# Altium schematic sheet power.SchDoc
size A4
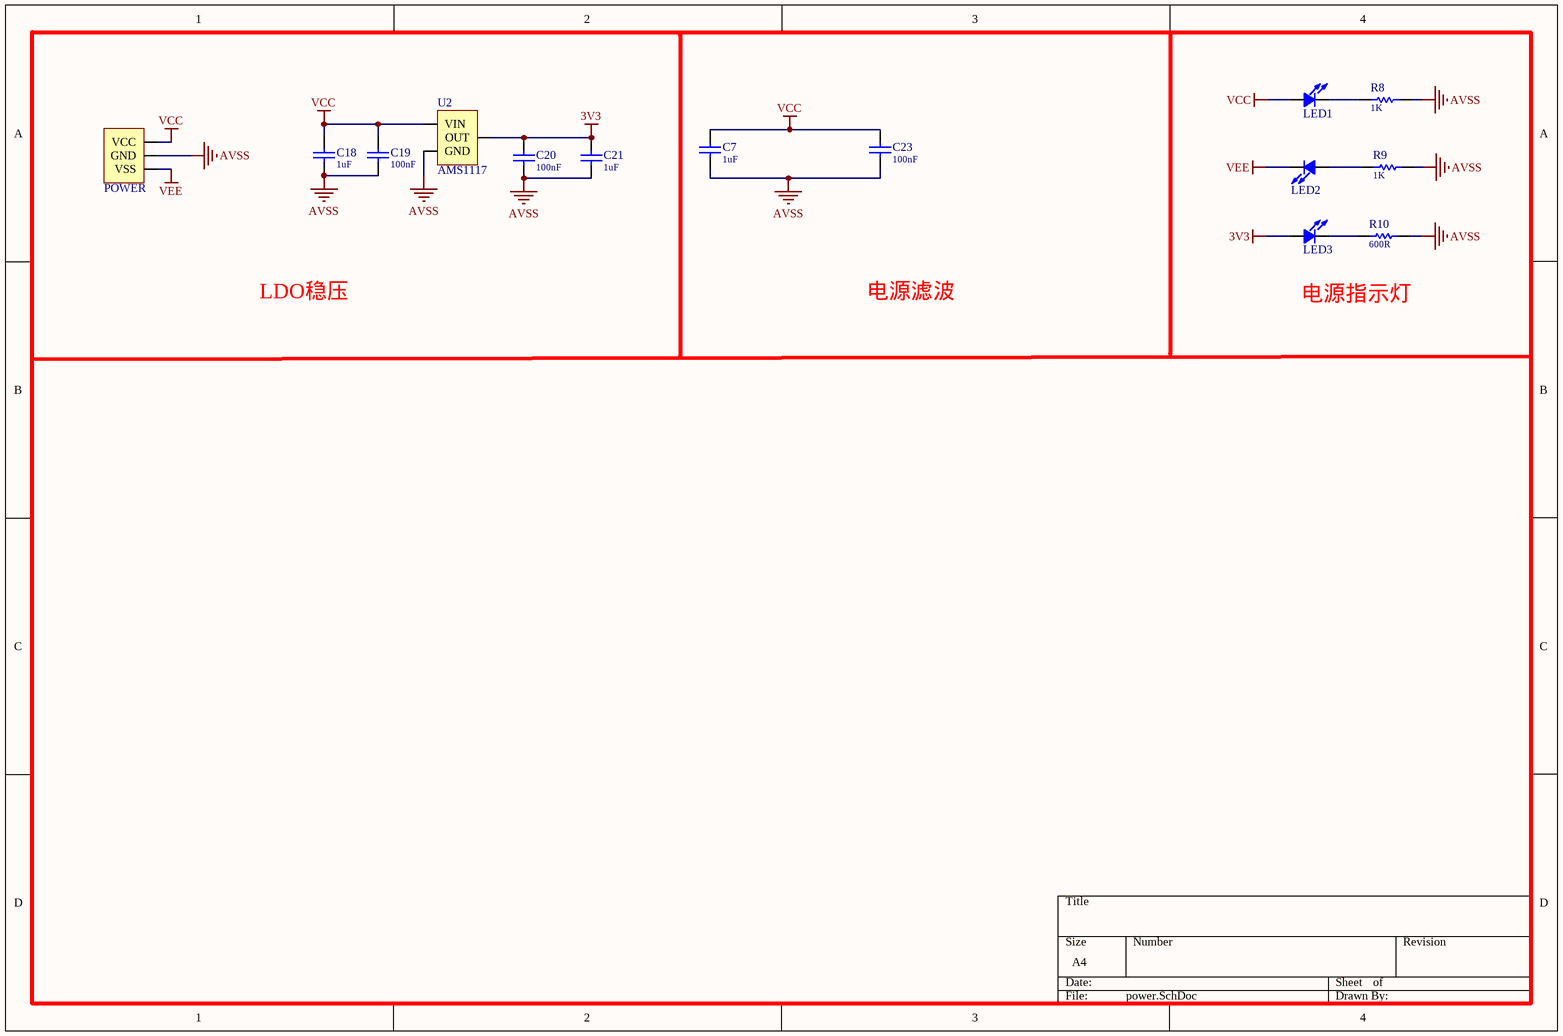
[diagram p0: power.SchDoc]

## Parts
C7  value 1uF  [C0603-L]  (hidden comment: Cap-S)
C18  value 1uF  [C0603-L]  (hidden comment: Cap-S)
C19  value 100nF  [C0603-L]  (hidden comment: Cap-S)
C20  value 100nF  [C0603-L]  (hidden comment: Cap-S)
C21  value 1uF  [C0603-L]  (hidden comment: Cap-S)
C23  value 100nF  [C0603-L]  (hidden comment: Cap-S)
LED1  LED  [Led-0805_L]  (value not drawn)
LED2  LED  [Led-0805_L]  (value not drawn)
LED3  LED  [Led-0805_L]  (value not drawn)
POWER  Power-3P  [SIPA03]  (value not drawn)
R8  value 1K  [R0603-L]  (hidden comment: R)
R9  value 1K  [R0603-L]  (hidden comment: R)
R10  value 600R  [R0603-L]  (hidden comment: R)
U2  AMS1117  [SOT-223]

## Nets
3V3: C20.2 C21.2 LED3.1 U2.2(OUT)
AVSS: C7.2 C18.1 C19.1 C20.1 C21.1 C23.2 POWER.2(GND) R8.2 R9.2 R10.2 U2.1(GND)
VCC: C7.1 C18.2 C19.2 C23.1 LED1.1 POWER.1(VCC) U2.3(VIN)
VEE: LED2.2 POWER.3(VSS)
NetLED1_2: LED1.2 R8.1
NetLED2_1: LED2.1 R9.1
NetLED3_2: LED3.2 R10.1

## Notes on the sheet
- LDO稳压
- 电源滤波
- 电源指示灯

## Library data of the parts
C7 C18-C21 C23 = Cap-S: 贴片瓷片电容
LED1-LED3 = LED: 发光二极管
POWER = Power-3P: 供电端子
R8-R10 = Res: 贴片电阻